# EAGLE design pcbmotor (EAGLE 5.09)
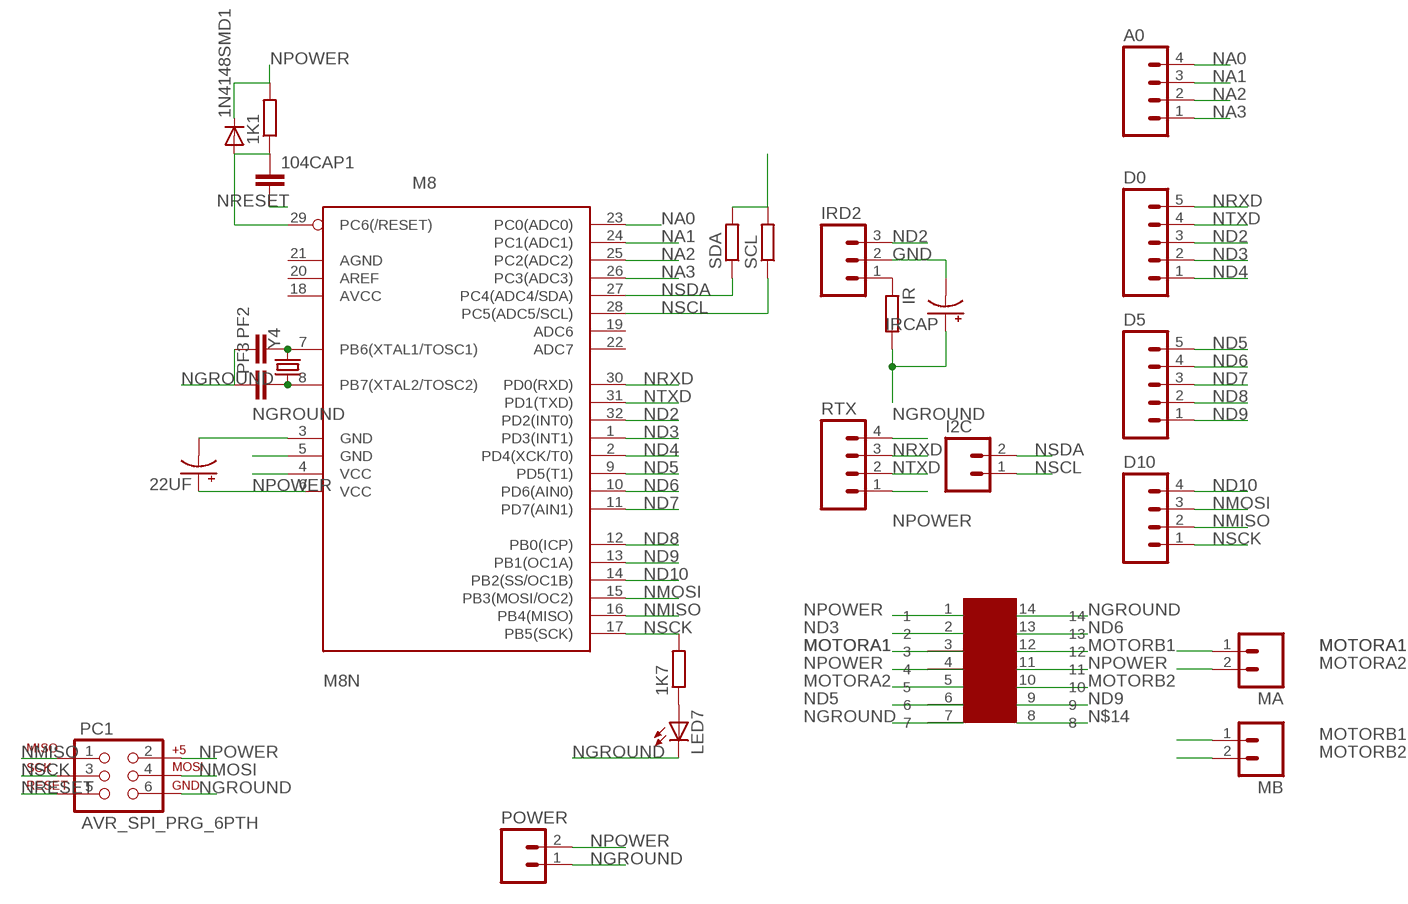
[diagram p0: schematic, sheet 1]

## Parts
1K1  R-EU_R0603  [R0603]
1K7  R-EU_R0603  [R0603]
1N4148SMD1  DIODESOD  [SOD-323]
22UF  CAP_POL3528  [EIA3528]
104CAP1  CAP0603-CAP  [0603-CAP]
A0  M04PTH  [1X04]
D0  M05PTH  [1X05]
D5  M05PTH  [1X05]
D10  M04PTH  [1X04]
I2C  M02PTH  [1X02]
IR  R-EU_R0603  [R0603]
IRCAP  CAP_POL3528  [EIA3528]
IRD2  M03PTH  [1X03]
LED7  LED-FKIT-1206  [FKIT-LED-1206]
M8N  M8  AVR-MEGA8-AI  [TQFP32-08]
MA  M02PTH  [1X02]
MB  M02PTH  [1X02]
PC1  AVR_SPI_PRG_6PTH  [2X3]
PF2  CAP0603-CAP  [0603-CAP]
PF3  CAP0603-CAP  [0603-CAP]
POWER  M02PTH  [1X02]
RTX  M04PTH  [1X04]
SCL  R-EU_R0603  [R0603]
SDA  R-EU_R0603  [R0603]
U$1  MFP14S  [MFP14S]
Y4  CRYSTALTC26H  [TC26H]

## Nets
GND: IRCAP.C(-) IRD2.2
MOTORA1: MA.1 U$1.3
MOTORA2: MA.2 U$1.5
MOTORB1: MB.1 U$1.12
MOTORB2: MB.2 U$1.10
N$14: U$1.8
N$17: M8N.7(PB6(XTAL1/TOSC1)) PF2.2 Y4.2
N$18: M8N.8(PB7(XTAL2/TOSC2)) PF3.2 Y4.1
N$31: 1K7.1 LED7.A
N$36: IR.1 IRD2.1
NA0: A0.4 M8N.23(PC0(ADC0))
NA1: A0.3 M8N.24(PC1(ADC1))
NA2: A0.2 M8N.25(PC2(ADC2))
NA3: A0.1 M8N.26(PC3(ADC3))
ND2: D0.3 IRD2.3 M8N.32(PD2(INT0))
ND3: D0.2 M8N.1(PD3(INT1)) U$1.2
ND4: D0.1 M8N.2(PD4(XCK/T0))
ND5: D5.5 M8N.9(PD5(T1)) U$1.6
ND6: D5.4 M8N.10(PD6(AIN0)) U$1.13
ND7: D5.3 M8N.11(PD7(AIN1))
ND8: D5.2 M8N.12(PB0(ICP))
ND9: D5.1 M8N.13(PB1(OC1A)) U$1.9
ND10: D10.4 M8N.14(PB2(SS/OC1B))
NGROUND: 22UF.C(-) 104CAP1.2 LED7.C M8N.3(GND) M8N.5(GND) PC1.6 PF2.1 PF3.1 POWER.1 RTX.4 U$1.7 U$1.14
NMISO: D10.2 M8N.16(PB4(MISO)) PC1.1
NMOSI: D10.3 M8N.15(PB3(MOSI/OC2)) PC1.4
NPOWER: 1K1.2 1N4148SMD1.1(C) 22UF.A(+) IR.2 IRCAP.A(+) M8N.4(VCC) PC1.2 POWER.2 RTX.1 SCL.2 SDA.2 U$1.4 U$1.11
NRESET: 1K1.1 1N4148SMD1.2(A) 104CAP1.1 M8N.29(PC6(/RESET)) PC1.5
NRXD: D0.5 M8N.30(PD0(RXD)) RTX.3
NSCK: 1K7.2 D10.1 M8N.17(PB5(SCK)) PC1.3
NSCL: I2C.1 M8N.28(PC5(ADC5/SCL)) SCL.1
NSDA: I2C.2 M8N.27(PC4(ADC4/SDA)) SDA.1
NTXD: D0.4 M8N.31(PD1(TXD)) RTX.2
Unconnected: M8N.6(VCC) M8N.18(AVCC) M8N.19(ADC6) M8N.20(AREF) M8N.21(AGND) M8N.22(ADC7) U$1.1

## Library data of the parts
1K1 1K7 IR SCL SDA = resistor:R-EU_: RESISTOR, European symbol
1N4148SMD1 = SparkFun:DIODE: Diode These are standard reverse protection diodes and small signal diodes. SMA package can handle up to about 1A. SOD-323 can handle about 200mA. What the SOD-323 package when ordering, there are some mfgs out there that are 5-pin packages.
22UF IRCAP = SparkFun:CAP_POL: Capacitor Polarized These are standard SMD and PTH capacitors. Normally 10uF, 47uF, and 100uF in electrolytic and tantalum varieties. Always verify the external diameter of the through hole cap, it varies with capacity, voltage, and manufacturer. The EIA devices should be standard.
104CAP1 PF2 PF3 = SparkFun:CAP: Capacitor Standard 0603 ceramic capacitor, and 0.1" leaded capacitor.
A0 D10 RTX = SparkFun:M04: Header 4 Standard 4-pin 0.1" header. Use with straight break away headers (SKU : PRT-00116), right angle break away headers (PRT-00553), swiss pins (PRT-00743), machine pins (PRT-00117), and female headers (PRT-00115). Molex polarized connector foot print use with SKU : PRT-08231 with associated crimp pins and housings. 1MM SMD Version SKU: PRT-10208
D0 D5 = SparkFun:M05: Header 5 Standard 5-pin 0.1" header. Use with straight break away headers (SKU : PRT-00116), right angle break away headers (PRT-00553), swiss pins (PRT-00743), machine pins (PRT-00117), and female headers (PRT-00115). Molex polarized connector foot print use with SKU : PRT-08230 with associated crimp pins and housings.
I2C MA MB POWER = SparkFun:M02: Header 2 Standard 2-pin 0.1" header. Use with straight break away headers (SKU : PRT-00116), right angle break away headers (PRT-00553), swiss pins (PRT-00743), machine pins (PRT-00117), and female headers (PRT-00115). Molex polarized connector foot print use with SKU : PRT-08233 with associated crimp pins and housings.
IRD2 = SparkFun:M03: Header 3 Standard 3-pin 0.1" header. Use with straight break away headers (SKU : PRT-00116), right angle break away headers (PRT-00553), swiss pins (PRT-00743), machine pins (PRT-00117), and female headers (PRT-00115). Molex polarized connector foot print use with SKU : PRT-08232 with associated crimp pins and housings.
LED7 = SparkFun:LED: LEDs Standard schematic elements and footprints for 5mm, 3mm, 1206, and 0603 sized LEDs. 5mm - Spark Fun Electronics SKU : COM-00529 (and others)
M8N = SparkFun:AVR-MEGA8: MICROCONTROLLER 8 Kbytes FLASH 1 kbytes SRAM 512 bytes EEPROM USART 6-channel 10 bit ADC 2-channel 8 bit ADC
PC1 = SparkFun:AVR_SPI_PRG_6: AVR ISP 6 Pin This is the reduced ISP connector for AVR programming. Common on Arduino. This footprint will take up less PCB space and can be used with a 10-pin to 6-pin adapter such as SKU: BOB-08508
U$1 = sunny:MFP14S
Y4 = SparkFun:CRYSTAL: Crystals Various standard crystals. Proven footprints. Spark Fun Electronics SKU : COM-00534

## Board
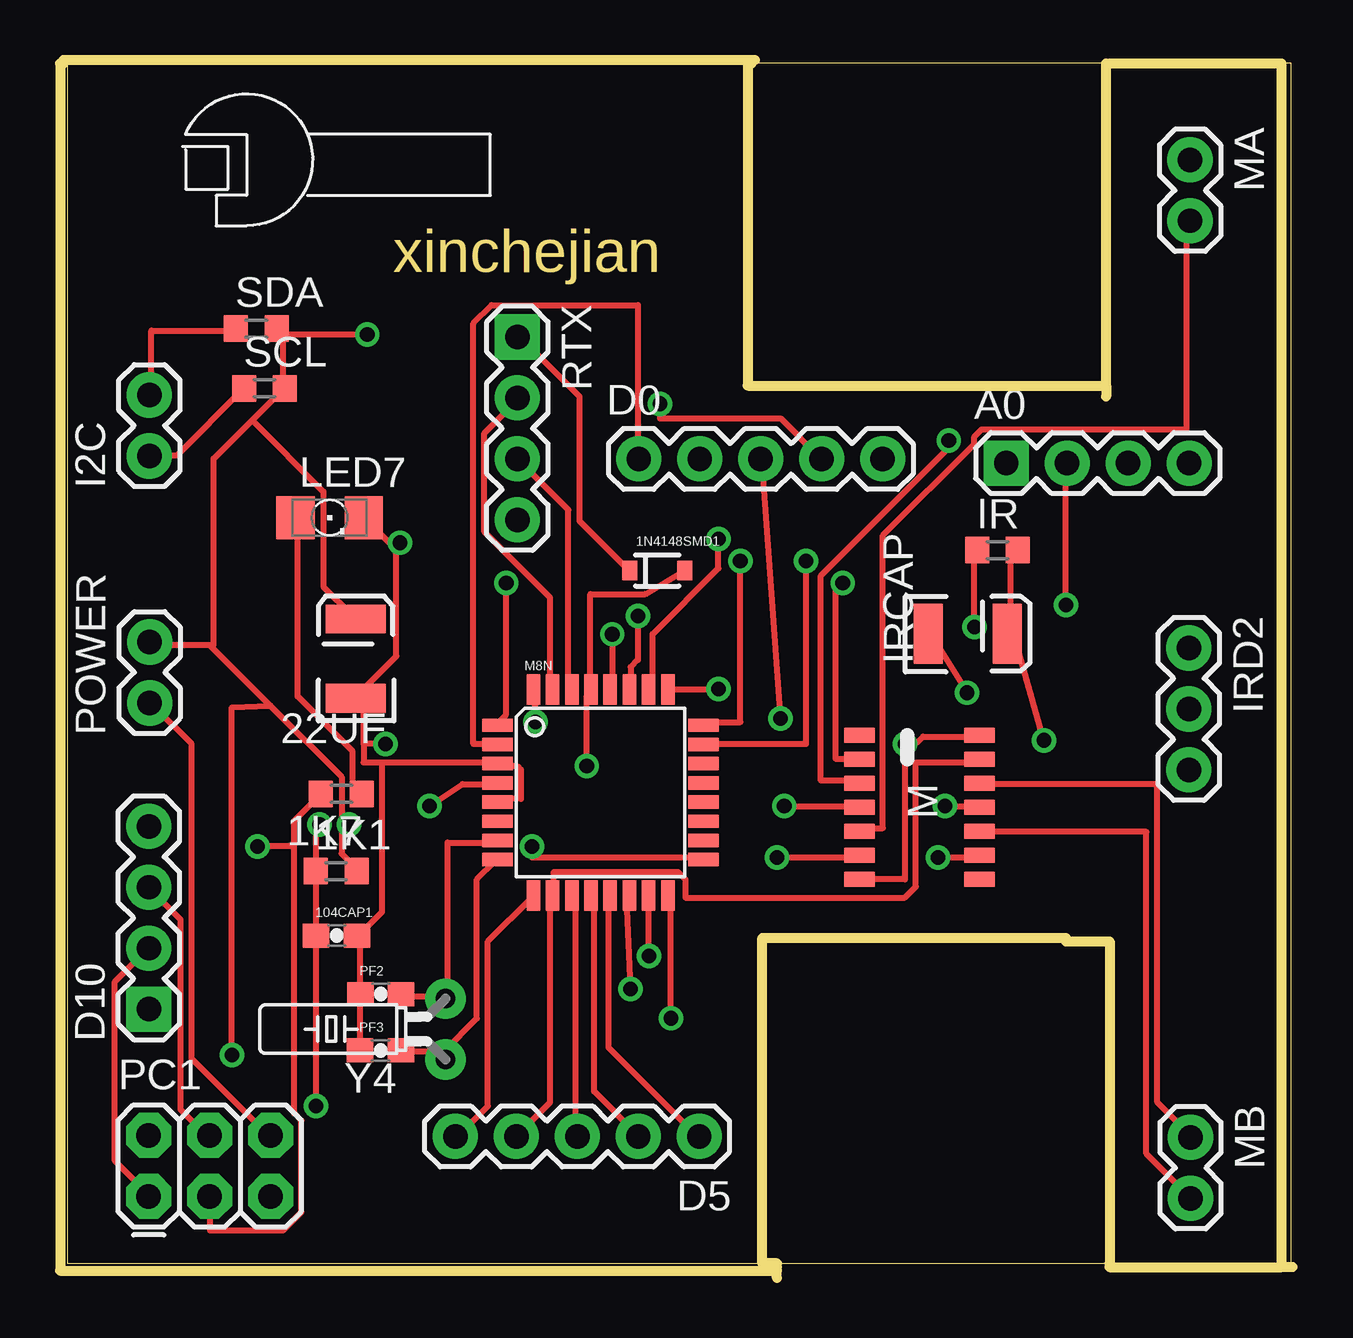
[diagram p1: board, top side]
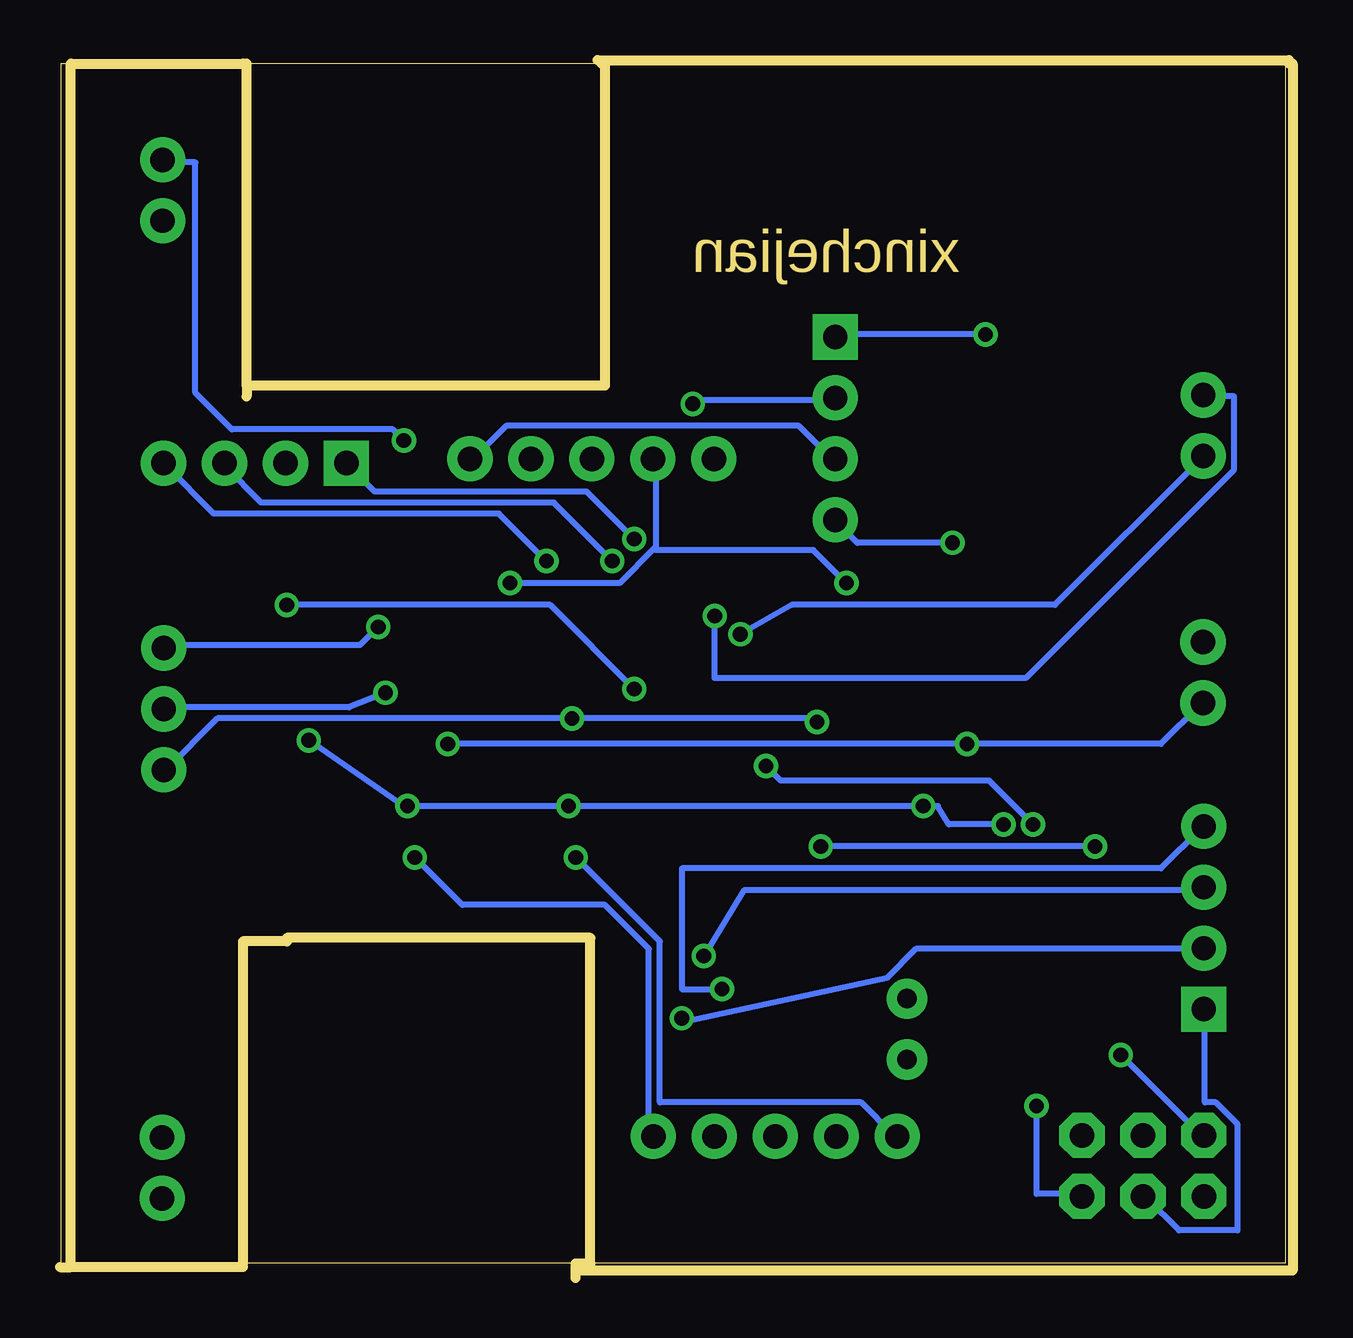
[diagram p2: board, bottom side, seen from below]

Size 51.36 x 50.75 mm. Coordinates in mm from the lower left corner, seen from the top.
Outline: 29.87,0.61 0.3,0.61 0.3,50.61 51.3,50.61 51.3,0.61 43.74,0.61
Outline: 29.87,0.61 43.74,0.61
Outline: 29.87,0.61 29.26,0.61 29.26,14.17 41.91,14.17 41.91,14.02 43.74,14.02 43.74,0.61
Outline: 28.8,50.6 28.65,50.6 28.65,37.19 43.59,37.19
Outline: 43.59,37.19 43.59,36.73
Outline: 43.59,37.19 43.59,50.6
Outline: 28.96,50.75 0.15,50.75 0.15,50.6 0,50.6 0,0.3 29.72,0.3
Outline: 29.87,0.3 29.87,0.46 29.72,0.46 29.72,0.3
Outline: 29.72,0.3 29.87,0.3
Outline: 29.87,0 29.87,0.3
Outline: 43.74,0.46 50.9,0.46
Outline: 51.36,0.46 50.9,0.46
Outline: 50.9,0.46 50.9,50.6 43.74,50.6
Copper layers (1*16): Top 0.035mm / dielectric 1.5mm / Bottom 0.035mm
Design rules "default": minimum track width 10mil, minimum drill 24mil, track to track 8mil, track to pad 8mil, pad to pad 8mil, via to via 8mil, smd to smd 8mil, copper to edge 40mil, drill to drill 8mil, minimum pad ring 10mil, minimum via ring 8mil, stop-mask expansion 4mil, vias tented up to drill 0mil, thermal gap 10mil

### Footprints (pad centres in the part's own frame; a part is rotated, then mirrored left to right if it is on the bottom)
R0603 = smd 1 x 1.1: 1 -0.85,0; 2 0.85,0
SOD-323 = smd 0.63 x 0.83: 1 -1.15,0; 2 1.15,0
EIA3528 = smd 1.2 x 2.5: A 1.65,0; C -1.65,0
0603-CAP = smd 1.1 x 1: 1 -0.85,0; 2 0.85,0
1X04 = drill 1.016 pad 1.88 square: 1 0,0 | drill 1.016 pad 1.88 round: 2 2.54,0; 3 5.08,0; 4 7.62,0
1X05 = drill 1.016 pad 1.88 round: 1 0,0; 2 2.54,0; 3 5.08,0; 4 7.62,0; 5 10.16,0
1X02 = drill 1.016 pad 1.88 round: 1 0,0; 2 2.54,0
1X03 = drill 1.016 pad 1.88 round: 1 0,0; 2 2.54,0; 3 5.08,0
FKIT-LED-1206 = smd 1.6 x 1.803: A -1.422,0; C 1.422,0
TQFP32-08 = smd 1.27 x 0.559: 1 -4.293,2.8; 2 -4.293,2; 3 -4.293,1.2; 4 -4.293,0.4; 5 -4.293,-0.4; 6 -4.293,-1.2; 7 -4.293,-2; 8 -4.293,-2.8; 17 4.293,-2.8; 18 4.293,-2; 19 4.293,-1.2; 20 4.293,-0.4; 21 4.293,0.4; 22 4.293,1.2; 23 4.293,2; 24 4.293,2.8 | smd 0.559 x 1.27: 9 -2.8,-4.293; 10 -2,-4.293; 11 -1.2,-4.293; 12 -0.4,-4.293; 13 0.4,-4.293; 14 1.2,-4.293; 15 2,-4.293; 16 2.8,-4.293; 25 2.8,4.293; 26 2,4.293; 27 1.2,4.293; 28 0.4,4.293; 29 -0.4,4.293; 30 -1.2,4.293; 31 -2,4.293; 32 -2.8,4.293
2X3 = drill 1.016 pad 1.88 octagon: 1 0,0; 2 0,2.54; 3 2.54,0; 4 2.54,2.54; 5 5.08,0; 6 5.08,2.54
MFP14S = smd 0.635 x 1.27: 1 1,-4; 2 2,-4; 3 3,-4; 4 4,-4; 5 5,-4; 6 6,-4; 7 7,-4; 8 7,1; 9 6,1; 10 5,1; 11 4,1; 12 3,1; 13 2,1; 14 1,1
TC26H = drill 0.813 pad 1.676 round: 1 -1.27,0; 2 1.27,0

### Placement (x,y rotation side)
1K1  11.5,16.95 0 top
1K7  11.72,20.17 180 top
1N4148SMD1  24.88,29.48 0 top
22UF  12.31,25.81 90 top
104CAP1  11.52,14.27 0 top
A0  39.42,33.95 0 top
D0  24.11,34.13 0 top
D5  26.63,5.9 180 top
D10  3.7,11.2 90 top
I2C  3.72,34.25 90 top
IR  39.06,30.33 0 top
IRCAP  37.82,26.85 0 top
IRD2  47.03,26.25 270 top
LED7  11.23,31.68 0 top
M8N  22.52,20.23 0 top
MA  47.08,46.59 270 top
MB  47.1,5.86 270 top
PC1  3.69,3.4 0 top
PF2  13.36,11.83 0 top
PF3  13.35,9.48 0 top
POWER  3.73,23.96 90 top
RTX  19.05,39.21 270 top
SCL  8.52,37.07 0 top
SDA  8.17,39.56 0 top
U$1  37.3,23.61 270 top
U$2  [XINCHEJIAN]  11.58,45.11 0 top
Y4  16.06,10.37 90 top

### Tracks (layer width: path | path; a pad name or v marks a point on that pad's centre or on a via)
GND  (via drill 0.61)
  Top 0.254: v37.79,24.38 36.27,26.82 IRCAP.C
  Bottom 0.254: v37.79,24.38 39.32,23.77 46.94,23.77 IRD2.2
MOTORA1  (via drill 0.61)
  Top 0.254: v37.03,34.9 37.03,34.59 31.7,29.26 31.7,20.73 33.22,20.73 U$1.3
  Bottom 0.254: v37.03,34.9 37.49,35.36 44.2,35.36 45.72,36.88 45.72,46.48 46.94,46.48 MA.1
MOTORA2
  Top 0.254: U$1.5 33.38,18.75 34.29,18.75 34.29,30.94 38.1,34.75 38.1,35.05 38.4,35.36 46.94,35.36 46.94,44.04 MA.2
MOTORB1
  Top 0.254: U$1.12 38.4,20.57 45.72,20.57 45.72,7.32 47.09,5.94 MB.1
MOTORB2
  Top 0.254: U$1.10 38.4,18.59 45.26,18.59 45.26,5.18 47.09,3.35 MB.2
N$17
  Top 0.254: PF2.2 14.33,11.73 16,11.73 Y4.2 16.15,11.73 16.15,18.14 18.14,18.14 M8N.7
N$18
  Top 0.254: 16,9.45 14.33,9.45 PF3.2 | 16,9.45 16,9.14 Y4.1 16,9.45 | 16,9.45 17.37,10.82 17.37,16.61 18.14,17.37 M8N.8
N$31
  Top 0.254: 1K7.1 12.5,20.27 12.19,20.57 12.19,21.95 9.91,24.23 9.91,31.55 LED7.A
N$36  (via drill 0.61)
  Top 0.254: v38.1,27.13 38.1,30.33 IR.1
  Bottom 0.254: v38.1,27.13 38.86,26.37 46.94,26.37 IRD2.1
NA0  (via drill 0.61)
  Top 0.254: v31.09,29.87 31.09,22.25 26.82,22.25 M8N.23
  Bottom 0.254: v31.09,29.87 33.07,31.85 44.96,31.85 46.94,33.83 A0.4
NA1  (via drill 0.61)
  Top 0.254: v28.35,29.87 28.35,23.16 26.82,23.16 M8N.24
  Bottom 0.254: v28.35,29.87 30.78,32.31 42.98,32.31 44.5,33.83 A0.3
NA2  (via drill 0.61)
  Top 0.254: v27.43,24.54 25.45,24.54 M8N.25 | v41.91,28.04 41.91,33.83 A0.2
  Bottom 0.254: v27.43,24.54 30.94,28.04 v41.91,28.04
NA3  (via drill 0.61)
  Top 0.254: v27.43,30.78 27.43,29.57 24.69,26.82 24.69,24.69 24.54,24.54 M8N.26
  Bottom 0.254: v27.43,30.78 29.41,32.77 38.25,32.77 39.32,33.83 A0.1
ND2  (via drill 0.61)
  Top 0.254: v19.81,23.16 19.81,24.38 M8N.32 | v30.02,23.32 29.26,33.99 D0.3
  Bottom 0.254: v19.81,23.16 19.96,23.32 v30.02,23.32 44.81,23.32 46.94,21.18 IRD2.3
ND3  (via drill 0.61)
  Top 0.254: v32.61,28.96 32.31,28.65 32.31,21.64 33.22,21.64 U$1.2 | v18.59,28.96 18.59,23.47 18.29,23.16 M8N.1
  Bottom 0.254: v32.61,28.96 28.04,28.96 26.59,30.4 | 26.59,30.4 26.52,30.48 26.52,33.99 D0.2 | v18.59,28.96 19.96,30.33 26.52,30.33 26.59,30.4
ND4
  Top 0.254: M8N.2 18.14,22.25 17.22,22.25 17.22,39.78 17.98,40.54 24.08,40.54 24.08,34.14 D0.1
ND5  (via drill 0.61)
  Top 0.254: M8N.9 19.66,15.85 17.83,14.02 17.83,7.16 16.61,5.94 D5.5 | v29.87,17.53 33.22,17.53 U$1.6
  Bottom 0.254: v29.87,17.53 26.36,14.02 26.36,7.32 17.98,7.32 16.61,5.94 D5.5
ND6
  Top 0.254: D5.4 19.05,5.94 20.42,7.32 20.42,15.85 M8N.10 20.57,16 20.57,16.92 25.76,16.92 26.06,16.61 26.06,15.85 35.2,15.85 35.66,16.31 35.66,21.49 38.25,21.49 U$1.13
ND7
  Top 0.254: M8N.11 21.34,15.85 21.49,15.7 21.49,5.94 D5.3
ND8
  Top 0.254: M8N.12 22.25,15.85 22.25,7.77 24.08,5.94 D5.2
ND9  (via drill 0.61)
  Top 0.254: M8N.13 22.86,15.85 22.86,9.6 26.52,5.94 D5.1 | v36.58,17.53 38.25,17.53 U$1.9
  Bottom 0.254: v36.58,17.53 34.59,15.54 28.65,15.54 26.82,13.72 26.82,5.94 26.67,5.94 D5.1
ND10  (via drill 0.61)
  Top 0.254: v23.77,12.04 23.62,15.85 M8N.14
  Bottom 0.254: v23.77,12.04 25.45,12.04 25.45,17.07 5.49,17.07 3.81,18.75 D10.4
NGROUND  (via drill 0.61)
  Top 0.254: PF3.1 12.5,9.6 12.5,11.73 PF2.1 12.5,11.89 12.5,14.17 104CAP1.2 12.5,14.33 13.41,15.24 13.41,21.49 | M8N.5 18.29,19.96 19.2,19.96 19.2,21.18 19.05,21.34 18.29,21.34 M8N.3 18.14,21.49 13.41,21.49 | 13.94,30.4 14.02,30.33 14.02,25.91 12.34,24.23 22UF.C 12.65,24.38 12.65,22.25 | 13.94,30.4 12.8,31.55 LED7.C | 13.41,21.49 12.65,21.49 12.65,22.25 | 13.94,30.4 v14.17,30.63 | 35.43,22.02 35.97,22.56 38.25,22.56 U$1.14 | 35.43,22.02 35.2,21.79 35.2,16.61 33.38,16.61 U$1.7 | PC1.6 8.69,5.94 5.49,9.14 5.49,22.25 3.81,23.93 POWER.1 | v35.2,22.25 35.43,22.02 | v13.56,22.25 12.65,22.25
  Bottom 0.254: v14.17,30.63 18.14,30.63 19.05,31.55 RTX.4 | v35.2,22.25 v13.56,22.25 5.49,22.25 3.81,23.93 POWER.1
NMISO  (via drill 0.61)
  Top 0.254: v25.45,10.82 25.45,15.85 M8N.16 | PC1.1 3.66,3.51 2.29,4.88 2.29,12.34 3.66,13.72 D10.2
  Bottom 0.254: v25.45,10.82 25.3,10.67 16.92,12.5 15.7,13.72 3.81,13.72 D10.2
NMOSI  (via drill 0.61)
  Top 0.254: v24.54,13.41 24.54,15.85 M8N.15 | PC1.4 6.1,5.94 5.03,7.01 5.03,14.94 3.81,16.15 D10.3
  Bottom 0.254: v24.54,13.41 22.86,16.15 3.81,16.15 D10.3
NPOWER  (via drill 0.61)
  Top 0.254: IR.2 39.78,30.33 39.62,30.18 39.62,26.97 IRCAP.A 39.62,26.82 39.78,26.67 v41,22.4 | v30.17,19.66 33.22,19.66 U$1.4 | v36.88,19.66 38.25,19.66 U$1.11 | v15.39,19.66 16.76,20.57 18.14,20.57 M8N.4 | 1N4148SMD1.1 23.62,29.57 21.64,31.55 21.64,36.73 19.2,39.17 RTX.1 | 9.3,39.32 9.14,39.47 SDA.2 9.3,39.32 | 9.3,39.32 9.3,37.19 SCL.2 9.3,37.03 8,35.74 | 11.73,18.9 11.73,20.88 8.76,23.85 | 11.73,18.9 11.73,17.68 12.34,17.07 1K1.2 | 6.32,26.29 6.25,26.37 3.81,26.37 POWER.2 | 8.76,23.85 6.32,26.29 | 8,35.74 6.4,34.14 6.4,26.37 6.32,26.29 | 22UF.A 12.19,27.58 10.97,28.8 10.97,32.77 8,35.74 | v7.16,9.3 7.16,23.77 8.76,23.85 | 9.3,39.32 v12.8,39.32 | 11.73,18.9 v12.04,18.9
  Bottom 0.254: v41,22.4 37.03,19.66 v36.88,19.66 v30.17,19.66 v15.39,19.66 14.78,19.66 14.33,18.9 v12.04,18.9 | v7.16,9.3 3.81,5.94 PC1.2 | v12.8,39.32 19.05,39.32 RTX.1
NRESET  (via drill 0.61)
  Top 0.254: 1N4148SMD1.2 25.91,29.41 24.38,28.5 22.1,28.5 22.1,24.54 M8N.29 22.1,24.38 21.95,24.23 v21.95,21.34 | v10.67,7.16 10.67,14.17 104CAP1.1 10.67,14.33 10.67,16.92 1K1.1 10.67,17.07 10.67,18.75 v10.82,18.9
  Bottom 0.254: v10.67,7.16 10.67,3.51 8.84,3.51 PC1.5 | v21.95,21.34 21.34,20.73 12.65,20.73 v10.82,18.9
NRXD
  Top 0.254: M8N.30 21.18,24.54 21.18,32 19.2,33.99 RTX.3
  Bottom 0.254: D0.5 34.14,34.14 32.77,35.51 20.57,35.51 19.2,34.14 RTX.3
NSCK  (via drill 0.61)
  Top 0.254: 9.75,17.98 9.75,6.86 10.06,6.55 10.06,2.74 9.3,1.98 6.25,1.98 6.25,3.35 PC1.3 | 9.75,17.98 9.75,19.05 10.82,20.12 1K7.2 | v19.66,17.98 19.66,17.53 26.67,17.53 M8N.17 | 9.75,17.98 v8.23,17.98
  Bottom 0.254: v8.23,17.98 v19.66,17.98 | D10.1 3.66,11.13 3.66,7.32 3.2,7.32 2.29,6.4 2.29,1.98 4.72,1.98 6.1,3.35 PC1.3
NSCL  (via drill 0.61)
  Top 0.254: SCL.1 7.62,37.03 4.88,34.29 3.81,34.29 I2C.1 | v23.01,26.82 23.01,24.54 M8N.28
  Bottom 0.254: v23.01,26.82 20.88,28.04 9.91,28.04 3.81,34.14 I2C.1
NSDA  (via drill 0.61)
  Top 0.254: SDA.1 7.31,39.47 3.81,39.47 3.81,36.88 I2C.2 | v24.08,27.58 24.08,25.76 23.77,25.45 23.77,24.54 M8N.27
  Bottom 0.254: v24.08,27.58 24.08,24.99 11.12,24.99 2.44,33.68 2.44,36.73 3.66,36.73 I2C.2
NTXD  (via drill 0.61)
  Top 0.254: M8N.31 20.42,24.54 20.42,28.35 17.68,31.09 17.68,35.2 19.05,36.58 RTX.2 | v24.99,36.42 24.99,35.81 30.02,35.81 31.7,34.14 D0.4
  Bottom 0.254: v24.99,36.42 24.84,36.58 19.2,36.58 RTX.2

### Text on the board
Dimension: xinchejian